# Altium schematic sheet INPUT_OUTPUT.SchDoc
size A4; SheetNumber: 6; SheetTotal: 7
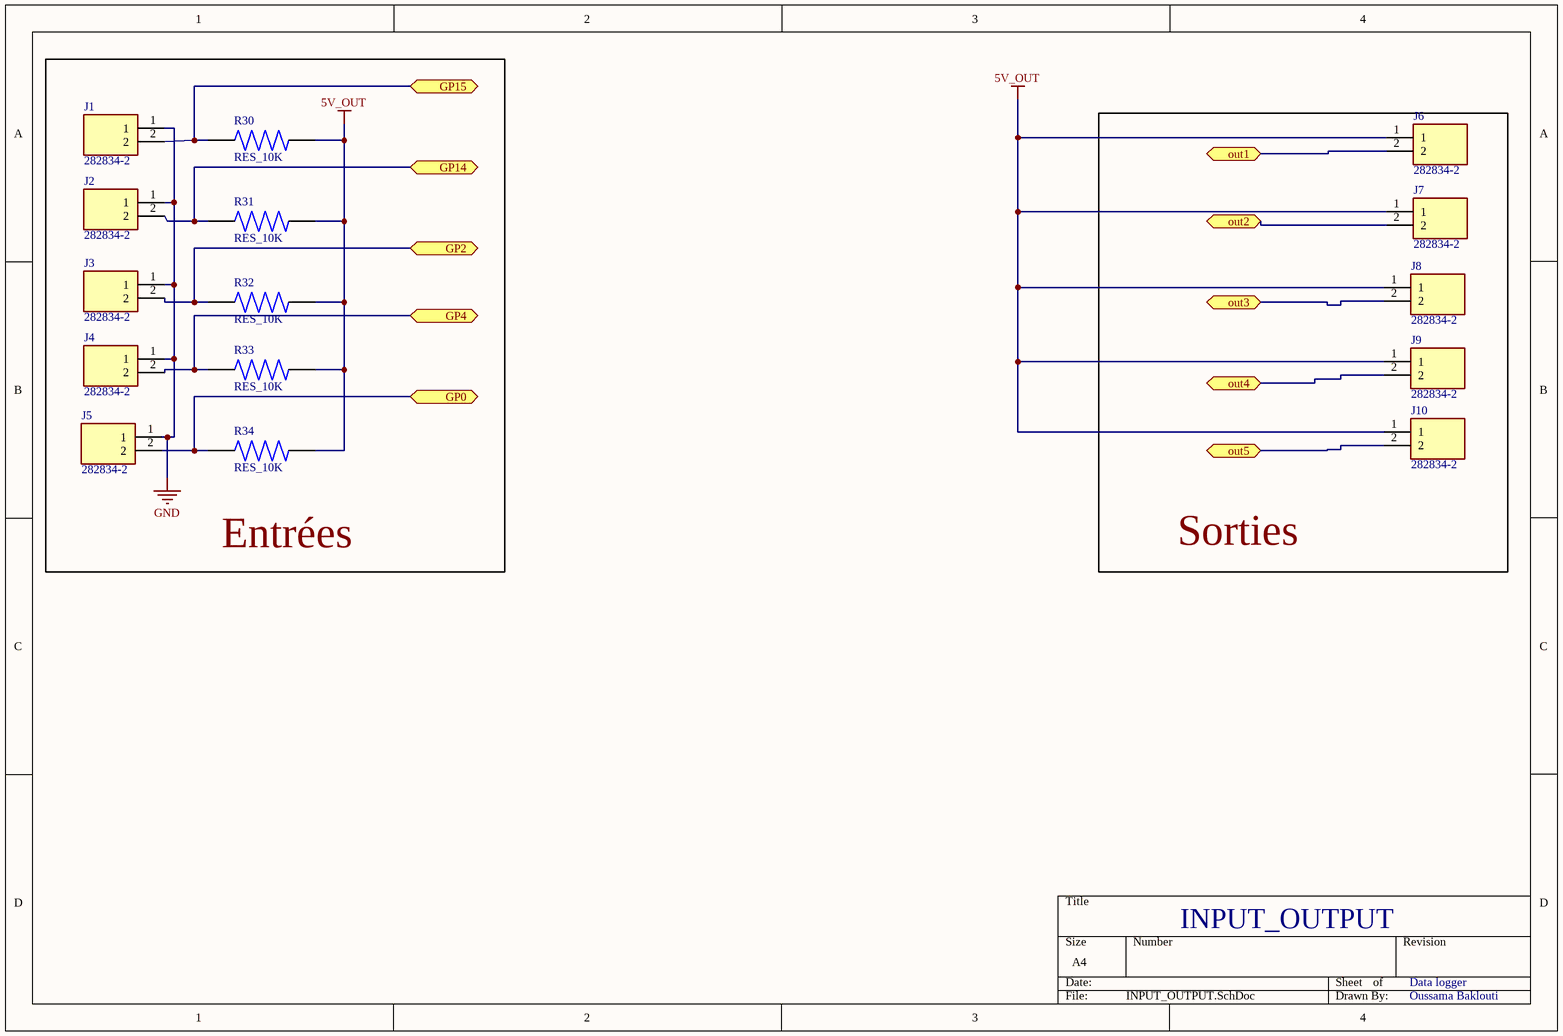
[diagram p0: INPUT_OUTPUT.SchDoc]

## Parts
J1  282834-2  [282834-2]
J2  282834-2  [282834-2]
J3  282834-2  [282834-2]
J4  282834-2  [282834-2]
J5  282834-2  [282834-2]
J6  282834-2  [282834-2]
J7  282834-2  [282834-2]
J8  282834-2  [282834-2]
J9  282834-2  [282834-2]
J10  282834-2  [282834-2]
R30  RES_10K  [RES_10k]
R31  RES_10K  [RES_10k]
R32  RES_10K  [RES_10k]
R33  RES_10K  [RES_10k]
R34  RES_10K  [RES_10k]

## Ports
GP0 (bidir), GP2 (bidir), GP4 (bidir), GP14 (bidir), GP15 (bidir), out1 (bidir), out2 (bidir), out3 (bidir), out4 (bidir), out5 (bidir)

## Nets
5V_OUT: J6.1 J7.1 J8.1 J9.1 J10.1 R30.2 R31.2 R32.2 R33.2 R34.2
GND: J1.1 J2.1 J3.1 J4.1 J5.1
GP0: J5.2 R34.1 ; port GP0
GP2: J3.2 R32.1 ; port GP2
GP4: J4.2 R33.1 ; port GP4
GP14: J2.2 R31.1 ; port GP14
GP15: J1.2 R30.1 ; port GP15
out1: J6.2 ; port out1
out2: J7.2 ; port out2
out3: J8.2 ; port out3
out4: J9.2 ; port out4
out5: J10.2 ; port out5

## Notes on the sheet
- INPUT_OUTPUT
- Data logger
- Oussama Baklouti
- Labels drawn without touching a wire or pin: Entrées, Sorties

## Library data of the parts
J1-J10 = 282834-2: Fixed Terminal Blocks 2P SIDE ENTRY 2.54mm; Mfr: TE Connectivity; Supplier: Mouser; Supplier réf: 571-282834-2; Mfr réf: 282834-2
R30-R34 = RES_10K: Thick Film Resistors - SMD ResHighPowerA 0805 10k 1% 1/2W TC100; Mfr: Bourns; Mfr réf: CMP0805AFX-1002ELF; Supplier: Mouser; Supplier réf: 652-CMP0805AFX-1002L; Footprint: R0805